# Altium project PCB_Project_1.PrjPcb
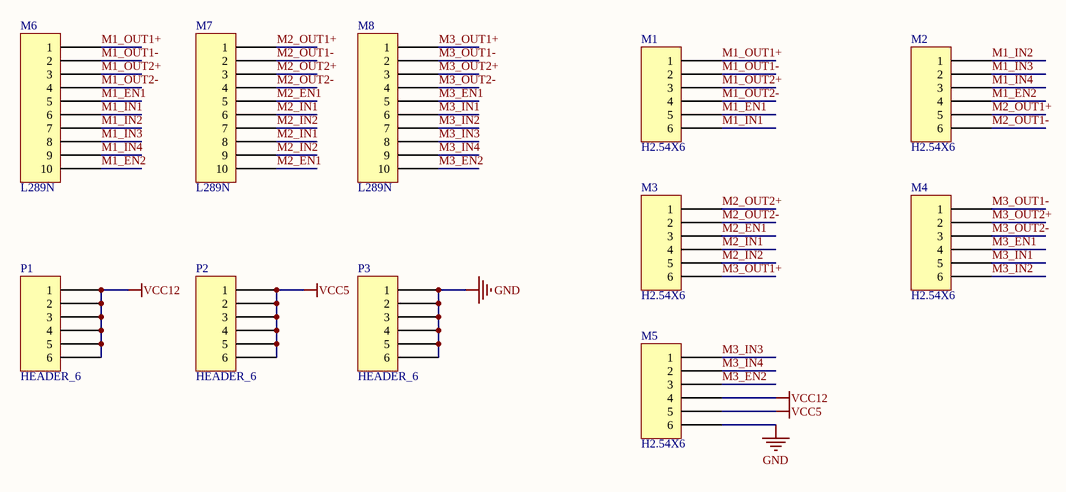
[diagram p0: Sheet1.SchDoc]
1 sheet, 11 parts. Net scope: global (net labels, ports and power ports of the same name join across sheets).
Board file: PCB1.PcbDoc

## Sheet Sheet1.SchDoc
size A4

### Parts
M1  H2.54X6  [Header6]
M2  H2.54X6  [Header6]
M3  H2.54X6  [Header6]
M4  H2.54X6  [Header6]
M5  H2.54X6  [Header6]
M6  L289N  [HDR1X10]
M7  L289N  [HDR1X10]
M8  L289N  [HDR1X10]
P1  HEADER_6  [HDR1X6]
P2  HEADER_6  [HDR1X6]
P3  HEADER_6  [HDR1X6]

### Nets
GND: M5.6 P3.1 P3.2 P3.3 P3.4 P3.5 P3.6
VCC5: M5.5 P2.1 P2.2 P2.3 P2.4 P2.5 P2.6
VCC12: M5.4 P1.1 P1.2 P1.3 P1.4 P1.5 P1.6
M1_EN1: M1.5 M6.5
M1_EN2: M2.4 M6.10
M1_IN1: M1.6 M6.6
M1_IN2: M2.1 M6.7
M1_IN3: M2.2 M6.8
M1_IN4: M2.3 M6.9
M1_OUT1+: M1.1 M6.1
M1_OUT1-: M1.2 M6.2
M1_OUT2+: M1.3 M6.3
M1_OUT2-: M1.4 M6.4
M2_EN1: M3.3 M7.5 M7.10
M2_IN1: M3.4 M7.6 M7.8
M2_IN2: M3.5 M7.7 M7.9
M2_OUT1+: M2.5 M7.1
M2_OUT1-: M2.6 M7.2
M2_OUT2+: M3.1 M7.3
M2_OUT2-: M3.2 M7.4
M3_EN1: M4.4 M8.5
M3_EN2: M5.3 M8.10
M3_IN1: M4.5 M8.6
M3_IN2: M4.6 M8.7
M3_IN3: M5.1 M8.8
M3_IN4: M5.2 M8.9
M3_OUT1+: M3.6 M8.1
M3_OUT1-: M4.1 M8.2
M3_OUT2+: M4.2 M8.3
M3_OUT2-: M4.3 M8.4